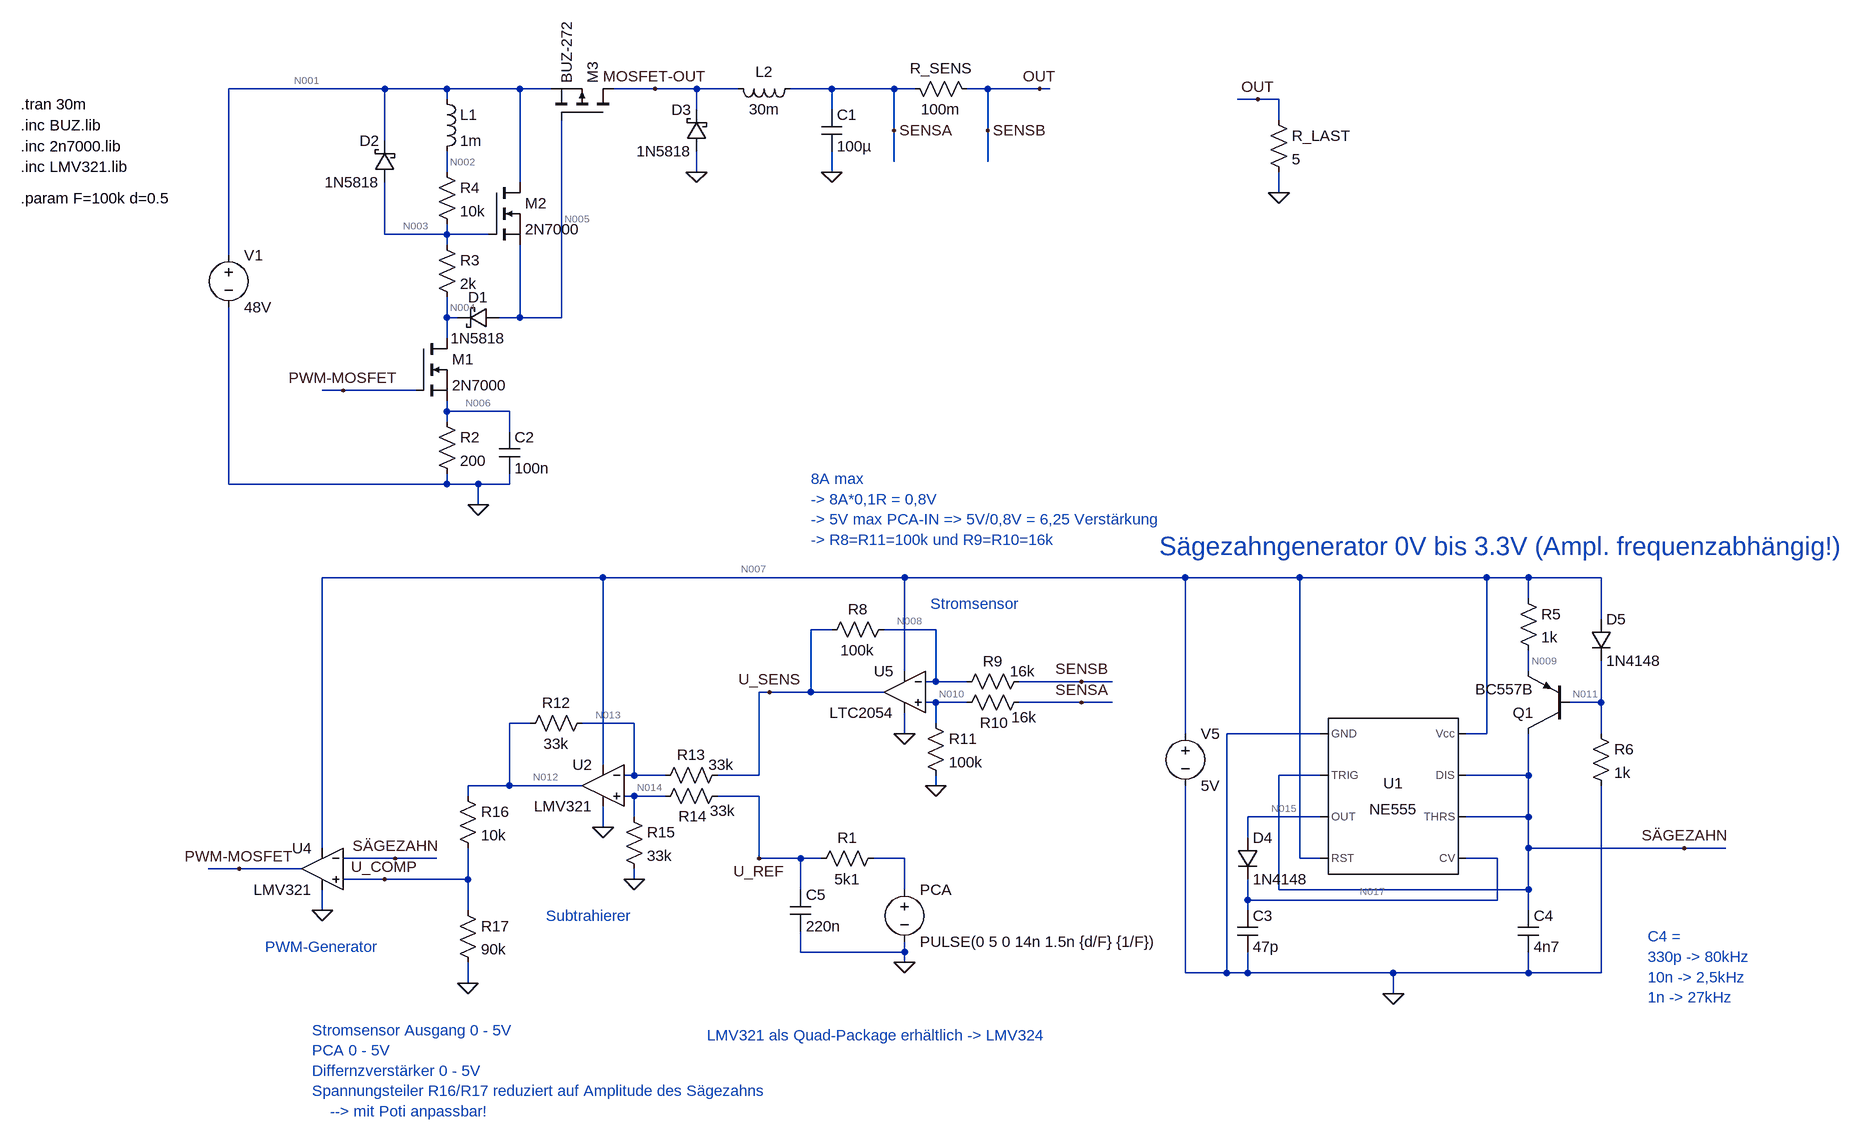
[diagram p0: schematic Hauptlichtsteuerung.asc]
Hauptlichtsteuerung.asc, the LTspice schematic file:
Version 4
SHEET 1 2276 2660
WIRE -400 32 -640 32
WIRE -304 32 -400 32
WIRE -192 32 -304 32
WIRE -144 32 -192 32
WIRE 16 32 -48 32
WIRE 80 32 16 32
WIRE 144 32 80 32
WIRE 288 32 224 32
WIRE 384 32 288 32
WIRE 416 32 384 32
WIRE 528 32 496 32
WIRE 608 32 528 32
WIRE 624 32 608 32
WIRE -304 48 -304 32
WIRE 944 48 912 48
WIRE 976 48 944 48
WIRE 80 64 80 32
WIRE 288 64 288 32
WIRE 976 80 976 48
WIRE 384 96 384 32
WIRE 528 96 528 32
WIRE -400 112 -400 32
WIRE 384 144 384 96
WIRE 528 144 528 96
WIRE -304 160 -304 128
WIRE 80 160 80 128
WIRE 288 160 288 128
WIRE -192 176 -192 32
WIRE 976 192 976 160
WIRE -400 256 -400 176
WIRE -304 256 -304 240
WIRE -304 256 -400 256
WIRE -240 256 -304 256
WIRE -304 272 -304 256
WIRE -640 288 -640 32
WIRE -304 384 -304 352
WIRE -288 384 -304 384
WIRE -192 384 -192 272
WIRE -192 384 -224 384
WIRE -128 384 -128 80
WIRE -128 384 -192 384
WIRE -304 416 -304 384
WIRE -464 496 -496 496
WIRE -352 496 -464 496
WIRE -304 528 -304 512
WIRE -208 528 -304 528
WIRE -304 544 -304 528
WIRE -208 560 -208 528
WIRE -640 640 -640 368
WIRE -304 640 -304 624
WIRE -304 640 -640 640
WIRE -256 640 -304 640
WIRE -208 640 -208 624
WIRE -208 640 -256 640
WIRE -256 672 -256 640
WIRE -64 784 -496 784
WIRE 400 784 -64 784
WIRE 832 784 400 784
WIRE 1008 784 832 784
WIRE 1296 784 1008 784
WIRE 1360 784 1296 784
WIRE 1472 784 1360 784
WIRE 1360 816 1360 784
WIRE 1472 848 1472 784
WIRE 288 864 256 864
WIRE 448 864 368 864
WIRE 400 928 400 784
WIRE 1360 928 1360 896
WIRE 448 944 448 864
WIRE 448 944 432 944
WIRE 496 944 448 944
WIRE 672 944 576 944
WIRE 720 944 672 944
WIRE 192 960 176 960
WIRE 256 960 256 864
WIRE 256 960 192 960
WIRE 368 960 256 960
WIRE 448 976 432 976
WIRE 496 976 448 976
WIRE 672 976 576 976
WIRE 720 976 672 976
WIRE 1472 976 1472 912
WIRE 1472 976 1424 976
WIRE -176 1008 -208 1008
WIRE -16 1008 -96 1008
WIRE 448 1008 448 976
WIRE 400 1024 400 992
WIRE 832 1024 832 784
WIRE 1040 1024 896 1024
WIRE 1296 1024 1296 784
WIRE 1296 1024 1264 1024
WIRE 1472 1024 1472 976
WIRE -64 1072 -64 784
WIRE -16 1088 -16 1008
WIRE -16 1088 -32 1088
WIRE 32 1088 -16 1088
WIRE 176 1088 176 960
WIRE 176 1088 112 1088
WIRE 1040 1088 976 1088
WIRE 1360 1088 1360 1024
WIRE 1360 1088 1264 1088
WIRE -208 1104 -208 1008
WIRE -208 1104 -272 1104
WIRE -96 1104 -208 1104
WIRE 448 1104 448 1088
WIRE -272 1120 -272 1104
WIRE -16 1120 -32 1120
WIRE 32 1120 -16 1120
WIRE 176 1120 112 1120
WIRE -16 1152 -16 1120
WIRE 1040 1152 928 1152
WIRE 1360 1152 1360 1088
WIRE 1360 1152 1264 1152
WIRE -64 1168 -64 1136
WIRE 928 1184 928 1152
WIRE -496 1200 -496 784
WIRE 1360 1200 1360 1152
WIRE 1600 1200 1360 1200
WIRE 1664 1200 1600 1200
WIRE -384 1216 -464 1216
WIRE -320 1216 -384 1216
WIRE 176 1216 176 1120
WIRE 240 1216 176 1216
WIRE 272 1216 240 1216
WIRE 400 1216 352 1216
WIRE 1008 1216 1008 784
WIRE 1040 1216 1008 1216
WIRE 1312 1216 1264 1216
WIRE -624 1232 -672 1232
WIRE -528 1232 -624 1232
WIRE -400 1248 -464 1248
WIRE -272 1248 -272 1200
WIRE -272 1248 -400 1248
WIRE -16 1248 -16 1232
WIRE 240 1264 240 1216
WIRE 400 1264 400 1216
WIRE 976 1264 976 1088
WIRE 1360 1264 1360 1200
WIRE 1360 1264 976 1264
WIRE 928 1280 928 1248
WIRE 1312 1280 1312 1216
WIRE 1312 1280 928 1280
WIRE -496 1296 -496 1264
WIRE -272 1296 -272 1248
WIRE 928 1296 928 1280
WIRE 1360 1296 1360 1264
WIRE 240 1360 240 1328
WIRE 400 1360 400 1344
WIRE 400 1360 240 1360
WIRE 400 1376 400 1360
WIRE 832 1392 832 1104
WIRE 896 1392 896 1024
WIRE 896 1392 832 1392
WIRE 928 1392 928 1360
WIRE 928 1392 896 1392
WIRE 1152 1392 928 1392
WIRE 1360 1392 1360 1360
WIRE 1360 1392 1152 1392
WIRE 1472 1392 1472 1104
WIRE 1472 1392 1360 1392
WIRE -272 1408 -272 1376
WIRE 1152 1424 1152 1392
FLAG -256 672 0
FLAG 80 160 0
FLAG 288 160 0
FLAG -464 496 PWM-MOSFET
FLAG 16 32 MOSFET-OUT
FLAG -384 1216 SÄGEZAHN
FLAG -496 1296 0
FLAG 400 1024 0
FLAG 448 1104 0
FLAG -624 1232 PWM-MOSFET
FLAG 608 32 OUT
FLAG 976 192 0
FLAG 944 48 OUT
FLAG 384 96 SENSA
FLAG 528 96 SENSB
FLAG 672 976 SENSA
FLAG 672 944 SENSB
FLAG 1152 1424 0
FLAG 1600 1200 SÄGEZAHN
FLAG -64 1168 0
FLAG -16 1248 0
FLAG -272 1408 0
FLAG 192 960 U_SENS
FLAG 176 1216 U_REF
FLAG -400 1248 U_COMP
FLAG 400 1376 0
SYMBOL nmos -352 416 R0
SYMATTR InstName M1
SYMATTR Value 2N7000
SYMATTR Prefix X
SYMBOL nmos -240 176 R0
SYMATTR InstName M2
SYMATTR Value 2N7000
SYMATTR Prefix X
SYMBOL res -320 528 R0
SYMATTR InstName R2
SYMATTR Value 200
SYMBOL cap -224 560 R0
SYMATTR InstName C2
SYMATTR Value 100n
SYMBOL schottky -224 368 R90
WINDOW 0 0 32 VBottom 2
WINDOW 3 32 32 VTop 2
SYMATTR InstName D1
SYMATTR Value 1N5818
SYMATTR Description Diode
SYMATTR Type diode
SYMBOL res -320 256 R0
SYMATTR InstName R3
SYMATTR Value 2k
SYMBOL res -320 144 R0
SYMATTR InstName R4
SYMATTR Value 10k
SYMBOL ind -320 32 R0
SYMATTR InstName L1
SYMATTR Value 1m
SYMBOL schottky -384 176 R180
WINDOW 0 24 64 Left 2
WINDOW 3 24 0 Left 2
SYMATTR InstName D2
SYMATTR Value 1N5818
SYMATTR Description Diode
SYMATTR Type diode
SYMBOL pmos -48 80 M270
SYMATTR InstName M3
SYMATTR Value BUZ-272
SYMATTR Prefix X
SYMBOL voltage -640 272 R0
WINDOW 123 0 0 Left 2
WINDOW 39 0 0 Left 2
SYMATTR InstName V1
SYMATTR Value 48V
SYMBOL ind 240 16 R90
WINDOW 0 5 56 VBottom 2
WINDOW 3 32 56 VTop 2
SYMATTR InstName L2
SYMATTR Value 30m
SYMBOL cap 272 64 R0
SYMATTR InstName C1
SYMATTR Value 100µ
SYMBOL schottky 96 128 R180
WINDOW 0 24 64 Left 2
WINDOW 3 24 0 Left 2
SYMATTR InstName D3
SYMATTR Value 1N5818
SYMATTR Description Diode
SYMATTR Type diode
SYMBOL res 960 64 R0
SYMATTR InstName R_LAST
SYMATTR Value 5
SYMBOL res 400 16 M90
WINDOW 0 0 56 VBottom 2
WINDOW 3 32 56 VTop 2
SYMATTR InstName R_SENS
SYMATTR Value 100m
SYMBOL Opamps\\opamp2 -496 1168 M0
SYMATTR InstName U4
SYMATTR Value LMV321
SYMBOL res 384 848 R90
WINDOW 0 0 56 VBottom 2
WINDOW 3 32 56 VTop 2
SYMATTR InstName R8
SYMATTR Value 100k
SYMBOL res 592 928 R90
WINDOW 0 0 56 VBottom 2
WINDOW 3 -16 10 VTop 2
SYMATTR InstName R9
SYMATTR Value 16k
SYMBOL res 592 960 R90
WINDOW 0 63 54 VBottom 2
WINDOW 3 23 8 VTop 2
SYMATTR InstName R10
SYMATTR Value 16k
SYMBOL res 432 992 R0
SYMATTR InstName R11
SYMATTR Value 100k
SYMBOL voltage 832 1008 R0
WINDOW 123 0 0 Left 2
WINDOW 39 0 0 Left 2
SYMATTR InstName V5
SYMATTR Value 5V
SYMBOL Misc\\NE555 1152 1120 R0
SYMATTR InstName U1
SYMBOL cap 912 1296 R0
SYMATTR InstName C3
SYMATTR Value 47p
SYMBOL cap 1344 1296 R0
SYMATTR InstName C4
SYMATTR Value 4n7
SYMBOL diode 912 1184 R0
SYMATTR InstName D4
SYMATTR Value 1N4148
SYMBOL res 1344 800 R0
SYMATTR InstName R5
SYMATTR Value 1k
SYMBOL res 1456 1008 R0
SYMATTR InstName R6
SYMATTR Value 1k
SYMBOL diode 1456 848 R0
SYMATTR InstName D5
SYMATTR Value 1N4148
SYMBOL pnp 1424 1024 R180
SYMATTR InstName Q1
SYMATTR Value BC557B
SYMBOL Opamps\\opamp2 -64 1040 M0
SYMATTR InstName U2
SYMATTR Value LMV321
SYMBOL res -80 992 R90
WINDOW 0 0 56 VBottom 2
WINDOW 3 32 56 VTop 2
SYMATTR InstName R12
SYMATTR Value 33k
SYMBOL res 128 1072 R90
WINDOW 0 0 56 VBottom 2
WINDOW 3 -16 10 VTop 2
SYMATTR InstName R13
SYMATTR Value 33k
SYMBOL res 128 1104 R90
WINDOW 0 63 54 VBottom 2
WINDOW 3 23 8 VTop 2
SYMATTR InstName R14
SYMATTR Value 33k
SYMBOL res -32 1136 R0
SYMATTR InstName R15
SYMATTR Value 33k
SYMBOL res -288 1104 R0
SYMATTR InstName R16
SYMATTR Value 10k
SYMBOL res -288 1280 R0
SYMATTR InstName R17
SYMATTR Value 90k
SYMBOL Opamps\\LTC2054 400 960 M0
SYMATTR InstName U5
SYMBOL voltage 400 1248 R0
WINDOW 123 0 0 Left 2
WINDOW 39 0 0 Left 2
SYMATTR InstName PCA
SYMATTR Value PULSE(0 5 0 14n 1.5n {d/F} {1/F})
SYMBOL res 368 1200 R90
WINDOW 0 0 56 VBottom 2
WINDOW 3 32 56 VTop 2
SYMATTR InstName R1
SYMATTR Value 5k1
SYMBOL cap 224 1264 R0
SYMATTR InstName C5
SYMATTR Value 220n
TEXT -960 56 Left 2 !.tran 30m
TEXT -960 88 Left 2 !.inc BUZ.lib
TEXT -960 120 Left 2 !.inc 2n7000.lib
TEXT -960 200 Left 2 !.param F=100k d=0.5
TEXT 792 736 Left 4 ;Sägezahngenerator 0V bis 3.3V (Ampl. frequenzabhängig!)
TEXT 440 824 Left 2 ;Stromsensor
TEXT -152 1304 Left 2 ;Subtrahierer
TEXT -584 1352 Left 2 ;PWM-Generator
TEXT 256 632 Left 2 ;8A max\n-> 8A*0,1R = 0,8V\n-> 5V max PCA-IN => 5V/0,8V = 6,25 Verstärkung\n-> R8=R11=100k und R9=R10=16k
TEXT -960 152 Left 2 !.inc LMV321.lib
TEXT 96 1488 Left 2 ;LMV321 als Quad-Package erhältlich -> LMV324
TEXT 1544 1336 Left 2 ;C4 = \n330p -> 80kHz\n10n -> 2,5kHz\n1n -> 27kHz
TEXT -512 1480 Left 2 ;Stromsensor Ausgang 0 - 5V\nPCA 0 - 5V\nDiffernzverstärker 0 - 5V\nSpannungsteiler R16/R17 reduziert auf Amplitude des Sägezahns\n    --> mit Poti anpassbar!

The netlist it stands for:
* Hauptlichtsteuerung.asc
XM1 N004 PWM-MOSFET N006 2N7000  ; pins D G S
XM2 N001 N003 N005 2N7000  ; pins D G S
R2 N006 0 200
C2 N006 0 100n
D1 N005 N004 1N5818
R3 N003 N004 2k
R4 N002 N003 10k
L1 N001 N002 1m
D2 N003 N001 1N5818
XM3 MOSFET-OUT N005 N001 BUZ-272  ; pins D G S
V1 N001 0 48V
L2 SENSA MOSFET-OUT 30m
C1 SENSA 0 100µ
D3 0 MOSFET-OUT 1N5818
R_LAST SENSB 0 5
R_SENS SENSA SENSB 100m
XU4 U_COMP SÄGEZAHN N007 0 PWM-MOSFET LMV321  ; pins In+ In- V+ V- OUT
R8 N008 U_SENS 100k
R9 SENSB N008 16k
R10 SENSA N010 16k
R11 N010 0 100k
V5 N007 0 5V
XU1 0 SÄGEZAHN N015 N007 N017 SÄGEZAHN SÄGEZAHN N007 NE555  ; pins GND TRIG OUT RST CV THRS DIS Vcc
C3 N017 0 47p
C4 SÄGEZAHN 0 4n7
D4 N015 N017 1N4148
R5 N007 N009 1k
R6 N011 0 1k
D5 N007 N011 1N4148
Q1 SÄGEZAHN N011 N009 0 BC557B
XU2 N014 N013 N007 0 N012 LMV321  ; pins In+ In- V+ V- OUT
R12 N013 N012 33k
R13 U_SENS N013 33k
R14 U_REF N014 33k
R15 N014 0 33k
R16 N012 U_COMP 10k
R17 U_COMP 0 90k
XU5 N010 N008 U_SENS N007 0 LTC2054  ; pins In+ In- OUT V+ V-
V§PCA N016 0 PULSE(0 5 0 14n 1.5n {d/F} {1/F})
R1 N016 U_REF 5k1
C5 U_REF 0 220n
.model D D
.lib standard.dio
.model NPN NPN
.model PNP PNP
.lib standard.bjt
.tran 30m
.inc BUZ.lib
.inc 2n7000.lib
.param F=100k d=0.5
* Sägezahngenerator 0V bis 3.3V (Ampl. frequenzabhängig!)
* Stromsensor
* Subtrahierer
* PWM-Generator
* 8A max
* -> 8A*0,1R = 0,8V
* -> 5V max PCA-IN => 5V/0,8V = 6,25 Verstärkung
* -> R8=R11=100k und R9=R10=16k
.inc LMV321.lib
* LMV321 als Quad-Package erhältlich -> LMV324
* C4 =
* 330p -> 80kHz
* 10n -> 2,5kHz
* 1n -> 27kHz
* Stromsensor Ausgang 0 - 5V
* PCA 0 - 5V
* Differnzverstärker 0 - 5V
* Spannungsteiler R16/R17 reduziert auf Amplitude des Sägezahns
*     --> mit Poti anpassbar!
.lib NE555.sub
.lib LTC2.lib
.backanno
.end

* Results of the author's LTspice run, read from the files saved beside the schematic
* Operating Point, zero values left out:
*   V(n004) = 47.98 V
*   V(n006) = 1.599 mV
*   V(pwm-mosfet) = -244.5 µV
*   V(n001) = 48 V
*   V(n005) = 47.98 V
*   V(n003) = 47.99 V
*   V(n002) = 48 V
*   V(sägezahn) = 4.947 V
*   V(u_comp) = 9.779 mV
*   V(n007) = 5 V
*   V(n008) = 8.451 µV
*   V(u_sens) = 60.24 µV
*   V(n010) = 142.7 nV
*   V(n017) = 4.463 V
*   V(n015) = 4.998 V
*   V(n009) = 4.952 V
*   V(n011) = 4.347 V
*   V(n013) = 5.32 mV
*   V(n014) = -311.7 µV
*   V(n012) = 10.99 mV
*   V(u_ref) = -41.73 µV
*   Ic(Q1) = -34.12 nA
*   Ib(Q1) = -48.47 µA
*   Ie(Q1) = 48.5 µA
*   I(D5) = 4.299 mA
*   I(D4) = 338.8 µA
*   I(D3) = -4.913 pA
*   I(D2) = -7.092 µA
*   I(D1) = 4.048 nA
*   I(L2) = -553 pA
*   I(L1) = 899.4 nA
*   I(R1) = 8.182 nA
*   I(R17) = 108.7 nA
*   I(R16) = 121.5 nA
*   I(R15) = -9.447 nA
*   I(R14) = 8.182 nA
*   I(R13) = -159.4 nA
*   I(R12) = -171.9 nA
*   I(R6) = 4.347 mA
*   I(R5) = 48.5 µA
*   I(R11) = 1.427 pA
*   I(R10) = -8.573 pA
*   I(R9) = -527.9 pA
*   I(R8) = -517.9 pA
*   I(R_sens) = 561.6 pA
*   I(R_last) = 1.089 nA
*   I(R4) = 899.4 nA
*   I(R3) = 7.992 µA
*   I(R2) = 7.996 µA
*   I(Pca) = -8.182 nA
*   I(V5) = -6.461 mA
*   I(V1) = -7.996 µA